# Altium schematic sheet Parts.SchDoc
size A; SheetNumber: 2; SheetTotal: 2
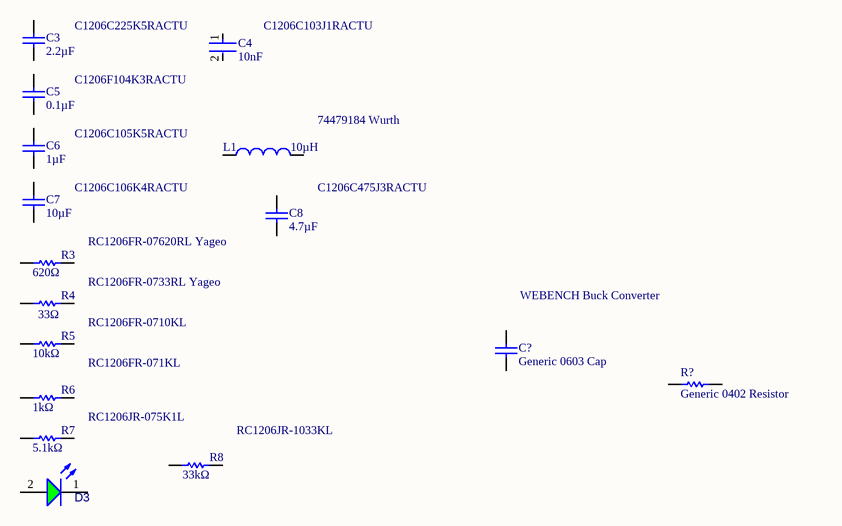
[diagram p0: Parts.SchDoc]

## Parts
C3  2.2µF  [CAPC3216X180X50LL20T25]
C4  10nF  [FP-C1206C-EB-MFG]
C5  0.1µF  [CAPC3216X100X50LL20T25]
C6  1µF  [CAPC3216X110X50LL20T25]
C7  10µF  [CAPC1206(3216)190_L]
C8  4.7µF  [CAPC1206(3216)190_L]
C?  Generic 0603 Cap  [CAP0603]
D3  150120GS75000  [WL-SMCW_1206_150120xx75000]  (value not drawn)
L1  10µH  [WE-MI_1206_L3.2W1.6H1.1]
R3  620Ω  [RESC3116X65X40LL10T20]
R4  33Ω  [RESC1206(3216)_L]
R5  10kΩ  [RESC3116X65X40LL10T20]
R6  1kΩ  [RESC3116X65X40LL10T20]
R7  5.1kΩ  [RESC3116X65X40LL10T20]
R8  33kΩ  [RESC3116X65X40LL10T20]
R?  Generic 0402 Resistor  [RESC1005X40X25NL05T05]

## Nets

Not connected (* = marked no-connect by the designer): C3 1 2; C4 1 2; C5 1 2; C6 1 2; C7 1 2; C8 1 2; C? 1 2; D3 1(K) 2(A); L1 1 2; R3 1 2; R4 1 2; R5 1 2; R6 1 2; R7 1 2; R8 1 2; R? 1 2

## Notes on the sheet
- C1206C225K5RACTU
- (near C4) C1206C103J1RACTU
- C1206F104K3RACTU
- C1206C105K5RACTU
- (near L1) 74479184 Wurth
- C1206C106K4RACTU
- (near R3) RC1206FR-07620RL Yageo
- C1206C475J3RACTU
- RC1206FR-0733RL Yageo
- (near C?) WEBENCH Buck Converter
- RC1206FR-0710KL
- RC1206FR-071KL
- RC1206JR-075K1L
- (near R8) RC1206JR-1033KL

## Library data of the parts
C3 = CMP-1037-04831-2: Chip Capacitor, 2.2 uF, +/- 10%, 50 V, -55 to 125 degC, 1206 (3216 Metric), RoHS, Tape and Reel; Manufacturer: Kemet; Case Width: 1.6mm; Capacitance - nF: 2200nF; Capacitance: 2.2uF; Class: Class1; Type: SMDMLCCX7R6.3-250VDCCommericalGrade; Voltage Rating: 50V; Case Length: 3.2mm; Dielectric: X7R; Temperature Coefficient / Code: +/-15%; Product Category: MultilayerCeramicCapacitorsMLCC-SMD/SMT; Package Description: 2-Pin Surface Mount Device, Body 3.2 x 1.6 mm; Minimum Operating Temperature: -55C; RoHS: Details; Package / Case: 1206(3216metric); Packaging: Reel; Case Code - mm: 3216; Datasheet Version: 02/2016; Tolerance: 10%; Series: C1206C; Dimensions: 1.6mmWx3.2mmLx1.6mmH; Case Height: 1.6mm; Brand: Kemet; Mounting Technology: SurfaceMount; Manufacturer URL: http://www.kemet.com/; Voltage Rating DC: 50V; Datasheet URL: http://www.kemet.com/docfinder?Partnumber=C1206C225K5RACTU; Maximum Operating Temperature: +125C; Case Code - in: 1206; Package Reference: 1206; Termination Style: SMD/SMT; Operating Temperature Range: -55Cto+125C; Product: GeneralTypeMLCCs; Factory Pack Quantity: 2000
C4 = CMP-03020-003656-1: CAP CER 10000PF 100V X7R 1206; Manufacturer: KEMET; Manufacturer Part Number: C1206C103J1RACTU; Temperature Coefficient: 15%; Capacitance: 10,000 pF; Automotive Grade: Grade 0; Value: 10,000 pF; Material: Ceramic; Tolerance: 0.05; Digikey Description: CAP CER 10000PF 100V X7R 1206; Temperature Range Low: -55°C; Height: 0.88mm; Automotive: Yes; Ipc Land Pattern Name: CAPC320160X78; ComponentLink2URL: https://content.kemet.com/datasheets/KEM_C1007_X8R_ULTRA_150C_SMD.pdf; Device Class L2: Capacitors; Mouser Description: 1206 C 10nF Ceramic Multilayer Capacitor, 100 VDC, +125degC, X7R Dielec, +/-5%; Octopart: https://octopart.com/c1206c103j1ractu-kemet-121270; Category: Cap; Temperature Characteristic: X7R; Voltage Rating: 100 V; Temperature: -55°C to +150°C; Device Class L1: Passive Components; RoHS: TRUE; Device Class L3: Ceramic Capacitors; Package: C1206C-EB; Lead Free: Yes; ComponentLink2Description: Datasheet; Temperature Range High: +150°C
C5 = CMP-1664-00001-4: Chip Capacitor, 100 nF, +/- 10%, 25 V, -55 to 125 degC, 1206 (3216 Metric), RoHS, Tape and Reel; Manufacturer: Kemet; Voltage Rating: 25 V; ComponentLink1URL: http://www.kemet.com/; Max Operating Temperature: 125 degC; PackageReference: 1206; ComponentLink2URL: http://www.kemet.com/docfinder?Partnumber=C1206F104K3RACTU; ComponentLink1Description: Manufacturer URL; ComponentLink2Description: Datasheet; Length: 3.2 mm; Packaging: Tape and Reel; Height: 0.78 mm; Mounting Technology: Surface Mount; REACH SVHC: No SVHC; PackageDescription: 2-Pin Surface Mount Device, Body 3.2 x 1.6 mm; Min Operating Temperature: -55 degC; RoHSCompliant: true; DatasheetVersion: 02/2016; Package Quantity: 4000
C6 = CMP-2000-06011-1: Chip Capacitor, 1 uF, +/- 10%, 50 V, -55 to 125 degC, 1206 (3216 Metric), RoHS, Tape and Reel; Manufacturer: Kemet; Case Height: 1mm; Dielectric: X7R; Voltage Rating: 50V; Capacitance: 1uF; Temperature Coefficient / Code: +/-15%; Case Length: 3.2mm; Case Width: 1.6mm; Type: SMDMLCCX7R6.3-250VDCCommericalGrade; Class: Class1; Capacitance - nF: 1000nF; Datasheet URL: http://www.kemet.com/docfinder?Partnumber=C1206C105K5RACTU; Product Category: MultilayerCeramicCapacitorsMLCC-SMD/SMT; Termination Style: SMD/SMT; Dimensions: 1.6mmWx3.2mmLx1mmH; Voltage Rating DC: 50V; Datasheet Version: 02/2016; Packaging: Reel; Brand: Kemet; RoHS: Details; Minimum Operating Temperature: -55C; Operating Temperature Range: -55Cto+125C; Package Reference: 1206; Manufacturer URL: http://www.kemet.com/; Product: GeneralTypeMLCCs; Tolerance: 10%; Package Description: 2-Pin Surface Mount Device, Body 3.2 x 1.6 mm; Mounting Technology: SurfaceMount; Case Code - mm: 3216; Maximum Operating Temperature: +125C; Series: C1206C; Factory Pack Quantity: 2500; Package / Case: 1206(3216metric); Case Code - in: 1206
C7 = CMP-1037-04961-1: CAP 10uF 6.3V ±10% 1206 (3216 Metric) Thickness 1.9mm SMD; Tolerance: Â±10%; Case-EIA: 1206; Case-Metric: 3216; Value: 10uF; Max Thickness: 1.9 mm; Technology: SMT; Rated Voltage: 6.3 V
C8 = CMP-1037-04917-1: CAP 4.7uF 25V ±5% 1206 (3216 Metric) Thickness 1.9mm SMD; Tolerance: Â±5%; Case-Metric: 3216; Case-EIA: 1206; Max Thickness: 1.9 mm; Rated Voltage: 25 V; Value: 4.7uF; Technology: SMT
C? = CMP-00319-6: Dielectric Material: Ceramic; Temperature Characteristics Code: X5R; Rated DC Voltage (URdc): 50V; Value: 1uF; Tolerance (fill in as +-): 10%; Multilayer: Yes; Package Style: SMTMeter; JESD-609 Code: e3; Min Operating Temperature: -55°C; Width: 0.8mm; Length: 1.6mm; Package Shape: Rectangular; Max Operating Temperature: 85°C; RoHS Compliant: Yes; Case/Package: 0603; Termination: Wraparound; Reach SVHC Compliant: Yes; Tolerance  (fill in as +-): 10%; Height: 0.9mm; Packaging: Tape and Reel; Capacitor Type: Ceramic; Terminal Finish: Nickel; Mounting Technology: Surface Mount; Pins: 2
D3 = CMP-1426-00014-4: WL-SMCW SMT Mono-Color Chip LED Waterclear; Dominant Wavelength: 525nm; Reverse Voltage: 5V; Max Junction Temperature (Tj): 95°C; Lens Style: Clear, Rectangular; Forward Voltage: 3.2V; Power Dissipation: 105mW; Peak Wavelength: 515nm; Test Current: 20mA; Color: Green; Forward Current: 100mA; Luminous Intensity: 450mcd; Viewing Angle: 140°; Case Code (Imperial): 1206; REACH SVHC: Unknown; Packaging: Tape and Reel; Max Operating Temperature: 85°C; Case/Package: 1206; Height: 680µm; Length: 3.2mm; Mount: Surface Mount; Min Operating Temperature: -40°C; Width: 1.6mm; Case Code (Metric): 3216; Max Reverse Voltage (DC): 5V; RoHS: Compliant; Wavelength: 525nm
L1 = CMP-0221-00030-2: NexarPartId: 23259292; Max DC Current: 25mA; Inductance Tolerance: 10%; Core Material: Ferrite; Shielding: Unshielded; DC Resistance (DCR): 500mΩ; Self Resonant Frequency: 26MHz; Ambient Temperature Range Low: -55°C; RoHS: Compliant; Inductance: 10µH; Tolerance: 10%; Length: 3.2mm; Width: 1.6mm; Case/Package: SMD/SMT; Min Operating Temperature: -55°C; Ambient Temperature Range High: 85°C; Depth: 1.6mm; Current Rating: 25mA; Max Operating Temperature: 125°C; Height: 1.1mm
R3 = CMP-2003-03994-1: Part Number: RC1206JR-07620RL; Manufacturer: Yageo
R4 = CMP-1014-00341-1: 33R 0.25W 1% 1206 (3216 Metric)  SMD; Case-EIA: 1206; Value: 33.00 Ohm; Case-Metric: 3216; Tolerance: 1 %; Technology: SMT; Power: 0.25 W
R5 = CMP-1014-00623-2: Chip Resistor, 10 KOhm, +/- 1%, 0.25 W, -55 to 155 degC, 1206 (3216 Metric), RoHS, Tape and Reel; Manufacturer: Yageo; Voltage Rating: 200V; Resistance: 10KOhm; Temperature Coefficient: 100ppm/degreesC; Power Rating: 250mW; Packaging: TapeandReel; Termination: SMD/SMT; REACH SVHC: Unknown; Tolerance: 1%; Height: 0.55mm; Composition: ThickFilm; Max Operating Temperature: 155degC; Datasheet Version: Rev. 5, 10/2016; Lead Free: LeadFree; Case Code (Metric): 3216; Depth: 1.6mm; Package Quantity: 5000; RoHSCompliant: true; Military Standard: Not; Case/Package: 1206; Case Code (Imperial): 1206; Min Operating Temperature: -55degC; Datasheet URL: http://www.yageo.com/NewPortal/yageodocoutput?fileName=/pdf/R-Chip/PYu-RC_Group_51_RoHS_L_5.pdf; Length: 3.1mm; Manufacturer URL: http://www.yageo.com/; Package Reference: 1206.0; Width: 1.6mm; Package Description: 2-Pin Surface Mount Device, Body 3.1 x 1.6 mm
R6 = CMP-2100-03678-1: Chip Resistor, 1 KOhm, +/- 1%, 0.25 W, -55 to 155 degC, 1206 (3216 Metric), RoHS, Tape and Reel; Manufacturer: Yageo; Temperature Coefficient: 100ppm/degreesC; Power Rating: 250mW; Voltage Rating: 200V; Resistance: 1KOhm; Composition: ThickFilm; Min Operating Temperature: -55degC; Tolerance: 1%; REACH SVHC: Unknown; Case Code (Metric): 3216; Military Standard: Not; Datasheet Version: Rev. 5, 10/2016; Package Reference: 1206.0; Case/Package: 1206; Length: 3.1mm; Manufacturer URL: http://www.yageo.com/; Lead Free: LeadFree; RoHSCompliant: true; Termination: SMD/SMT; Packaging: TapeandReel; Package Description: 2-Pin Surface Mount Device, Body 3.1 x 1.6 mm; Depth: 1.6mm; Case Code (Imperial): 1206; Max Operating Temperature: 155degC; Datasheet URL: http://www.yageo.com/NewPortal/yageodocoutput?fileName=/pdf/R-Chip/PYu-RC_Group_51_RoHS_L_5.pdf; Height: 0.55mm
R7 = CMP-2003-03990-1: Manufacturer: Yageo; Part Number: RC1206JR-075K1L
R8 = CMP-2003-03510-1: Part Number: RC1206JR-1033KL; Manufacturer: Yageo
R? = CMP-2000-07451-1: Manufacturer: Panasonic; Voltage Rating (DC): 50V; Temperature Coefficient: 600ppm/��C; Max Power Dissipation: 100mW; Resistance: 0mOhm; Tolerance: 5%; Number of Terminations: 2; Mount: SurfaceMount; Height: 0.35mm; Packaging: TapeandReel; Contact Plating: Tin; Manufacturer URL: http://www.panasonic.com/; Composition: ThickFilm; Max Operating Temperature: 155degC; REACH SVHC: NoSVHC; Case/Package: 0402; Package Reference: 402; Depth: 0.5mm; Package Description: 2-Pin Surface Mount Device, Body 1 x 0.5 mm; Datasheet URL: https://industrial.panasonic.com/cdbs/www-data/pdf/RDA0000/AOA0000C301.pdf; RoHSCompliant: True; Case Code (Imperial): 0402; Military Standard: Not; Min Operating Temperature: -55degC; Power Rating: 100mW; Datasheet Version: 03/2015; Length: 1mm; Case Code (Metric): 1005; Termination: SMD/SMT; Mounting Technology: SurfaceMount; Voltage Rating: 50V; Width: 0.02inch; Package Quantity: 1; Lead Free: LeadFree; Radiation Hardening: No